# EasyEDA Pro project ProProject_zelda_guardian.epro, schematic head_sub_sch
Create Date: 2023-06-13; Page Name: P1; Project Name: zelda_guardian; Schematic Name: head_sub_sch; Update Date: 2023-06-23; Company: 嘉立创EDA; Page Size: A4; Version: V1.0
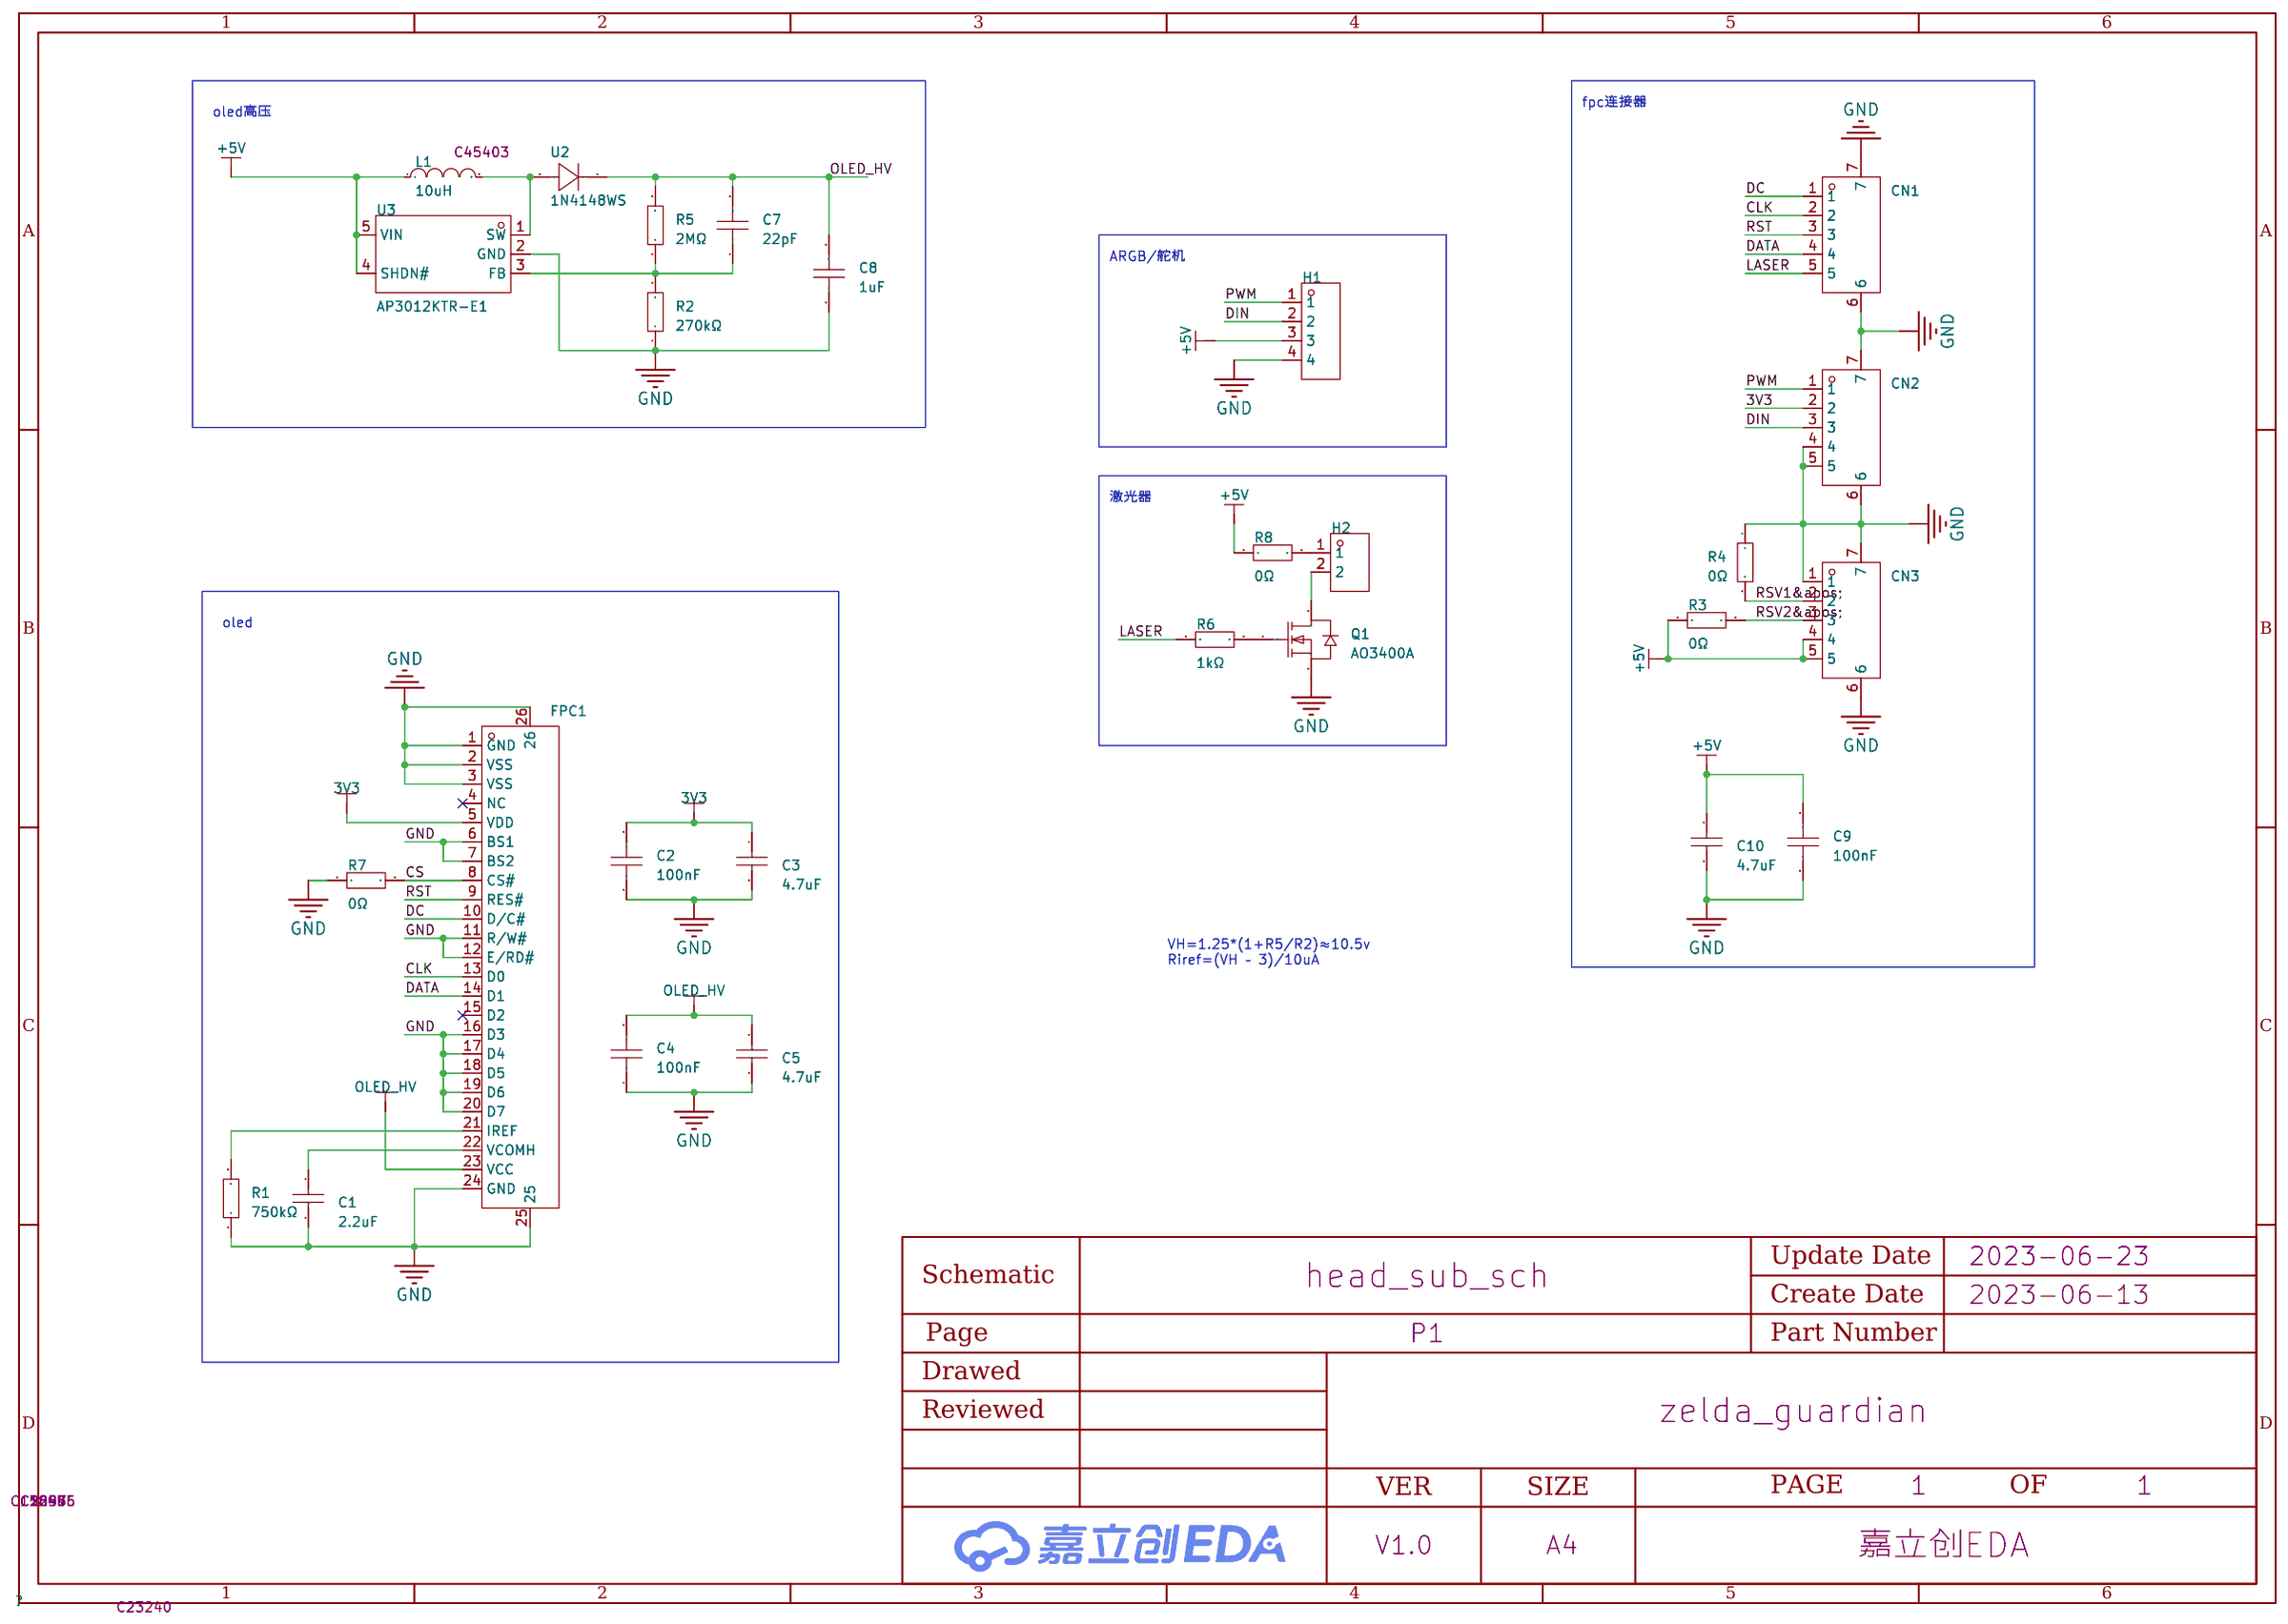
[diagram p4: schematic sheet]

## Parts
C1  2.2uF  [C0603]
C2  100nF  [C0603]
C3  4.7uF  [C0603]
C4  100nF  [C0603]
C5  4.7uF  [C0603]
C7  22pF  [C0603]
C8  1uF  [C0603]
C9  100nF  [C0603]
C10  4.7uF  [C0603]
CN1  0.5K-QX-5PWB  [FPC-SMD_5P-P0.50_HDGC_0.5K-QX-5PWB]
CN2  0.5K-QX-5PWB  [FPC-SMD_5P-P0.50_HDGC_0.5K-QX-5PWB]
CN3  0.5K-QX-5PWB  [FPC-SMD_5P-P0.50_HDGC_0.5K-QX-5PWB]
FPC1  FPC-05FB-24PH20  [FPC-SMD_24P-P0.50_FPC-05FB-24PH20]
H1  PZ254V-11-04P  [HDR-TH_4P-P2.54-V-M]
H2  PZ254V-11-02P  [HDR-TH_2P-P2.54-V-M]
L1  10uH  [IND-SMD_L3.0-W3.0_SWPA3010S]
Q1  AO3400A  [SOT-23-3_L2.9-W1.6-P1.90-LS2.8-BR]
R1  750kΩ  [R0603]
R2  270kΩ  [R0603]
R3  0Ω  [R0603]
R4  0Ω  [R0603]
R5  2MΩ  [R0603]
R6  1kΩ  [R0603]
R7  0Ω  [R0603]
R8  0Ω  [R0603]
U2  1N4148WS  [SOD-323_L1.8-W1.3-LS2.5-RD]
U3  AP3012KTR-E1  [TSOT-23-5_L2.9-W1.6-P0.95-LS2.8-BR]

## Library data of the parts
C1 = CL10A225KO8NNNC: 容值:2.2uF;精度:±10%;额定电压:16V;材质(温度系数):X5R;; LCSC Part Name: 2.2uF ±10% 16V; Supplier Part: C23630; Manufacturer: SAMSUNG(三星); Supplier Footprint: 0603; JLCPCB Part Class: Basic Part; Datasheet: https://atta.szlcsc.com/upload/public/pdf/source/20160103/1457707709512.pdf; Supplier: LCSC; Tolerance: ±10%; Voltage Rated: 16V; Temperature Coefficient: X5R
C2 C4 C9 = CC0603KRX7R9BB104: 容值:100nF;精度:±10%;额定电压:50V;材质(温度系数):X7R;; LCSC Part Name: 100nF ±10% 50V; Supplier Part: C14663; Manufacturer: YAGEO(国巨); Supplier Footprint: 0603; JLCPCB Part Class: Basic Part; Datasheet: https://atta.szlcsc.com/upload/public/pdf/source/20180910/C282072_33301C7F631E79921B82A8DAC6BCC5B3.pdf; Supplier: LCSC; Tolerance: ±10%; Voltage Rated: 50V; Temperature Coefficient: X7R
C3 C5 C10 = CL10A475KO8NNNC: 容值:4.7uF;精度:±10%;额定电压:16V;材质(温度系数):X5R;; LCSC Part Name: 4.7uF ±10% 16V; Supplier Part: C19666; Manufacturer: SAMSUNG(三星); Supplier Footprint: 0603; JLCPCB Part Class: Basic Part; Datasheet: https://atta.szlcsc.com/upload/public/pdf/source/20160103/1457707703134.pdf; Supplier: LCSC; Tolerance: ±10%; Voltage Rated: 16V; Temperature Coefficient: X5R
C7 = CL10C220JB8NNNC: 容值:22pF;精度:±5%;额定电压:50V;材质(温度系数):C0G;; LCSC Part Name: 22pF ±5% 50V; Supplier Part: C1653; Manufacturer: SAMSUNG(三星); Supplier Footprint: 0603; JLCPCB Part Class: Basic Part; Datasheet: https://atta.szlcsc.com/upload/public/pdf/source/20160103/1457707687317.pdf; Supplier: LCSC; Tolerance: ±5%; Voltage Rated: 50V; Temperature Coefficient: C0G
C8 = CL10A105KB8NNNC: 容值:1uF;精度:±10%;额定电压:50V;材质(温度系数):X5R;; LCSC Part Name: 1uF ±10% 50V; Supplier Part: C15849; Manufacturer: SAMSUNG(三星); Supplier Footprint: 0603; JLCPCB Part Class: Basic Part; Datasheet: https://atta.szlcsc.com/upload/public/pdf/source/20160103/1457707679084.pdf; Supplier: LCSC; Tolerance: ±10%; Voltage Rated: 50V; Temperature Coefficient: X5R
CN1-CN3 = 0.5K-QX-5PWB: 间距:0.5mm;触点数量:5;锁定特性:翻盖式;安装类型:卧贴;触点类型:下接;工作温度范围:-55℃~+85℃;; LCSC Part Name: 0.5mm P数:5 翻盖式 下接; Supplier Part: C2919476; Manufacturer: HDGC(华德共创); Supplier Footprint: SMD,P=0.5mm; JLCPCB Part Class: Extended Part; Datasheet: https://atta.szlcsc.com/upload/public/pdf/source/20211115/55A448787CA70A1AD4E6404A5BEFA17C.pdf; Supplier: LCSC; Pitch: 0.5mm; Number of Contacts: 5; Locking Feature: 翻盖式; Mounting Type: 卧贴; Contact Type: 下接; Height Above Board: 1mm; FFC, FCB Thickness: 0.3mm; Operating Temperature Range: -55℃~+85℃
FPC1 = OLED_FPC: 间距:0.5mm;触点数量:24;锁定特性:翻盖式;安装类型:卧贴;触点类型:双侧触点/上下接;工作温度范围:-25℃~+85℃;; LCSC Part Name: 0.5mm P数:24 翻盖式 双侧触点/上下接; Supplier Part: C2856831; Manufacturer: XUNPU(讯普); Supplier Footprint: SMD,P=0.5mm; JLCPCB Part Class: Extended Part; Datasheet: https://atta.szlcsc.com/upload/public/pdf/source/20210922/C2856831_717985F95873A81D5C0B7E3F2E5E5327.pdf; Supplier: LCSC; Pitch: 0.5mm; Number of Contacts: 24; Locking Feature: 翻盖式; Mounting Type: 卧贴; Contact Type: 双侧触点/上下接; Height Above Board: 2mm; FFC, FCB Thickness: 0.3mm; Operating Temperature Range: -25℃~+85℃
H1 = 接线孔4p: 排数:单排;总PIN位数:4;间距:2.54mm;插针结构:1x4P;行距:-;安装类型:直插;圆针/方针:方针;额定电流:3A;额定电压:250V;配合针长度:6mm;塑高:2.5mm;端接针长度:3mm;触头材质:-;工作温度范围:-40℃~+105℃;颜色:黑色;; LCSC Part Name: 2.54mm 1x4P 直插 方针; Supplier Part: C2691448; Manufacturer: XFCN(兴飞); Supplier Footprint: 直插,P=2.54mm; JLCPCB Part Class: Extended Part; Datasheet: https://atta.szlcsc.com/upload/public/pdf/source/20200309/C492403_F9F19131791D08044AD4F84F8E751A34.pdf; Supplier: LCSC; Number of Rows: 单排; Number of Pins: 4; Pitch: 2.54mm; Pin Structure: 1x4P; Mounting Type: 直插; Circluar Pins/Square Pins: 方针; Current Rating (Max): 3A; Voltage Rating (Max): 250V; Length of Mating Pin: 6mm; Insulation Height: 2.5mm; Length of End Connection Pin: 3mm; Operating Temperature Range: -40℃~+105℃; Color: 黑色
H2 = 接线孔2p: 排数:单排;总PIN位数:2;间距:2.54mm;插针结构:1x2P;行距:-;安装类型:直插;圆针/方针:方针;额定电流:-;额定电压:-;配合针长度:6mm;塑高:2.5mm;端接针长度:3mm;触头材质:黄铜;触头镀层:-;工作温度范围:-40℃~+105℃;颜色:黑色;; LCSC Part Name: 2.54mm 1x2P 直插 方针; Supplier Part: C492401; Manufacturer: XFCN(兴飞); Supplier Footprint: 直插,P=2.54mm; JLCPCB Part Class: Extended Part; Datasheet: https://atta.szlcsc.com/upload/public/pdf/source/20200309/C492401_A812433581A9B211A7FFA413ADDFF0E5.pdf; Supplier: LCSC; Number of Rows: 单排; Number of Pins: 2; Pitch: 2.54mm; Pin Structure: 1x2P; Mounting Type: 直插; Circluar Pins/Square Pins: 方针; Length of Mating Pin: 6mm; Insulation Height: 2.5mm; Length of End Connection Pin: 3mm; Contact Material: 黄铜; Operating Temperature Range: -40℃~+105℃; Color: 黑色
L1 = SWPA3015S100MT: 电感值:10uH;精度:±20%;额定电流:770mA;直流电阻(DCR):325mΩ;; LCSC Part Name: 10uH ±20% 770mA 325mΩ; Supplier Part: C45403; Manufacturer: Sunlord(顺络); Supplier Footprint: SMD; JLCPCB Part Class: Extended Part; Datasheet: https://atta.szlcsc.com/upload/public/pdf/source/20210916/AC798BA7E846B7D0B6818F45CD84DB0B.pdf; Supplier: LCSC; Tolerance: ±20%; Rated Current: 770mA; DC Resistance (DCR): 325mΩ; Q @ Freq: 30@2MHz; Frequency - Self Resonant: 2MHz
Q1 = AO3400A_C20917: 类型:N沟道;漏源电压(Vdss):30V;连续漏极电流(Id):5.7A;功率(Pd):1.4W;导通电阻(RDS(on)@Vgs,Id):26.5mΩ@10V,5.7A;; LCSC Part Name: N沟道 30V 5.7A; Supplier Part: C20917; Manufacturer: AOS; Supplier Footprint: SOT-23-3L; JLCPCB Part Class: Basic Part; Datasheet: https://atta.szlcsc.com/upload/public/pdf/source/20140107/1457706668533.pdf; Supplier: LCSC; Type: N沟道; Drain Source Voltage (Vdss): 30V; Continuous Drain Current (Id): 5.7A; Power Dissipation (Pd): 1.4W; Drain Source On Resistance (RDS(on)@Vgs,Id): 26.5mΩ@10V,5.7A; Gate Threshold Voltage (Vgs(th)@Id): 1.5V@250uA
R1 = 0603WAF7503T5E: 电阻类型:厚膜电阻;阻值:750kΩ;精度:±1%;功率:100mW;; LCSC Part Name: 750kΩ ±1% 100mW; Supplier Part: C23240; Manufacturer: UNI-ROYAL(厚声); Supplier Footprint: 0603; JLCPCB Part Class: Basic Part; Datasheet: https://atta.szlcsc.com/upload/public/pdf/source/20200306/C422600_1E6D84923E4A46A82E41ADD87F860B5C.pdf; Supplier: LCSC; Type: 厚膜电阻; Tolerance: ±1%; Power(Watts): 100mW; Temperature Coefficient: ±100ppm/℃; Overload Voltage (Max): 75V; Operating Temperature Range: -55℃~+155℃
R2 = 0603WAF2703T5E: 电阻类型:厚膜电阻;阻值:270kΩ;精度:±1%;功率:100mW;; LCSC Part Name: 270kΩ ±1% 100mW; Supplier Part: C22965; Manufacturer: UNI-ROYAL(厚声); Supplier Footprint: 0603; JLCPCB Part Class: Basic Part; Datasheet: https://atta.szlcsc.com/upload/public/pdf/source/20200306/C422600_1E6D84923E4A46A82E41ADD87F860B5C.pdf; Supplier: LCSC; Type: 厚膜电阻; Tolerance: ±1%; Power(Watts): 100mW; Temperature Coefficient: ±100ppm/℃; Overload Voltage (Max): 75V; Operating Temperature Range: -55℃~+155℃
R3 R4 R7 R8 = 0603WAF0000T5E: 电阻类型:厚膜电阻;阻值:0Ω;精度:±1%;功率:100mW;; LCSC Part Name: 0Ω ±1% 100mW; Supplier Part: C21189; Manufacturer: UNI-ROYAL(厚声); Supplier Footprint: 0603; JLCPCB Part Class: Basic Part; Datasheet: https://atta.szlcsc.com/upload/public/pdf/source/20200306/C422600_1E6D84923E4A46A82E41ADD87F860B5C.pdf; Supplier: LCSC; Type: 厚膜电阻; Tolerance: ±1%; Power(Watts): 100mW; Overload Voltage (Max): 75V; Operating Temperature Range: -55℃~+155℃
R5 = 0603WAF2004T5E: 电阻类型:厚膜电阻;阻值:2MΩ;精度:±1%;功率:100mW;; LCSC Part Name: 2MΩ ±1% 100mW; Supplier Part: C22976; Manufacturer: UNI-ROYAL(厚声); Supplier Footprint: 0603; JLCPCB Part Class: Basic Part; Datasheet: https://atta.szlcsc.com/upload/public/pdf/source/20200306/C422600_1E6D84923E4A46A82E41ADD87F860B5C.pdf; Supplier: LCSC; Type: 厚膜电阻; Tolerance: ±1%; Power(Watts): 100mW; Temperature Coefficient: ±100ppm/℃; Overload Voltage (Max): 75V; Operating Temperature Range: -55℃~+155℃
R6 = 0603WAF1001T5E: 电阻类型:厚膜电阻;阻值:1kΩ;精度:±1%;功率:100mW;; LCSC Part Name: 1kΩ ±1% 100mW; Supplier Part: C21190; Manufacturer: UNI-ROYAL(厚声); Supplier Footprint: 0603; JLCPCB Part Class: Basic Part; Datasheet: https://atta.szlcsc.com/upload/public/pdf/source/20200306/C422600_1E6D84923E4A46A82E41ADD87F860B5C.pdf; Supplier: LCSC; Type: 厚膜电阻; Tolerance: ±1%; Power(Watts): 100mW; Temperature Coefficient: ±100ppm/℃; Overload Voltage (Max): 75V; Operating Temperature Range: -55℃~+155℃
U2 = 1N4148WS_C2128: 二极管配置:独立式;功率:200mW;直流反向耐压(Vr):100V;平均整流电流(Io):150mA;正向压降(Vf):1.25V@150mA;反向电流(Ir):1uA@75V;反向恢复时间(trr):4ns;工作温度:+150℃@(Tj);; LCSC Part Name: 100V 150mA 4ns T4; Supplier Part: C2128; Manufacturer: CJ(江苏长电/长晶); Supplier Footprint: SOD-323; JLCPCB Part Class: Basic Part; Datasheet: https://atta.szlcsc.com/upload/public/pdf/source/20140809/1457707208178.pdf; Supplier: LCSC; Diode Configuration: 独立式; Power Dissipation: 200mW; Reverse Voltage (Vr): 100V; Average Rectified Current (Io): 150mA; Forward Voltage (Vf@If): 1.25V@150mA; Reverse Leakage Current: 1uA@75V; Reverse Recovery Time (trr): 4ns; Operating Temperature: +150℃@(Tj)
U3 = AP3012KTR-E1: Supplier Part: C460356; Manufacturer: DIODES(美台); Supplier Footprint: SOT-23-5; JLCPCB Part Class: Extended Part; Datasheet: https://atta.szlcsc.com/upload/public/pdf/source/20191127/C460356_AACB9653A67EC58211AB2AB041FDC9A0.pdf; Supplier: LCSC

## Nets
3V3: C2.2 C3.1 CN2.2 FPC1.5(VDD)
+5V: C9.1 C10.1 CN3.4 CN3.5 H1.3 L1.1 R3.1 R8.1 U3.4(SHDN#) U3.5(VIN)
GND: C1.2 C2.1 C3.2 C4.1 C5.2 C8.1 C9.2 C10.2 CN1.6 CN1.7 CN2.4 CN2.5 CN2.6 CN2.7 CN3.1 CN3.6 CN3.7 FPC1.1(GND) FPC1.2(VSS) FPC1.3(VSS) FPC1.6(BS1) FPC1.7(BS2) FPC1.11(R/W#) FPC1.12(E/RD#) FPC1.16(D3) FPC1.17(D4) FPC1.18(D5) FPC1.19(D6) FPC1.20(D7) FPC1.24(GND) FPC1.25 FPC1.26 H1.4 Q1.2(S) R1.1 R2.1 R4.1 R7.1 U3.2(GND)
CLK: CN1.2 FPC1.13(D0)
CS: FPC1.8(CS#) R7.2
DATA: CN1.4 FPC1.14(D1)
DC: CN1.1 FPC1.10(D/C#)
DIN: CN2.3 H1.2
LASER: CN1.5 R6.1
OLED_HV: C4.2 C5.1 C7.2 C8.2 FPC1.23(VCC) R5.2 U2.1(K)
PWM: CN2.1 H1.1
RST: CN1.3 FPC1.9(RES#)
RSV1&apos;: CN3.2 R4.2
RSV2&apos;: CN3.3 R3.2
$1N1034: C1.1 FPC1.22(VCOMH)
$1N1552: L1.2 U2.2(A) U3.1(SW)
$1N1946: C7.1 R2.2 R5.1 U3.3(FB)
$1N5101: FPC1.21(IREF) R1.2
$1N10250: Q1.1(G) R6.2
$1N10268: H2.2 Q1.3(D)
$1N10317: H2.1 R8.2

Not connected (* = marked no-connect by the designer): FPC1 4(NC)* 15(D2)*

## Notes on the sheet
- fpc连接器
- oled高压
- ARGB/舵机
- 激光器
- oled
- VH=1.25*(1+R5/R2)≈10.5v
  Riref=(VH – 3)/10uA
